# Altium schematic sheet PUTTY.SchDoc
size A4
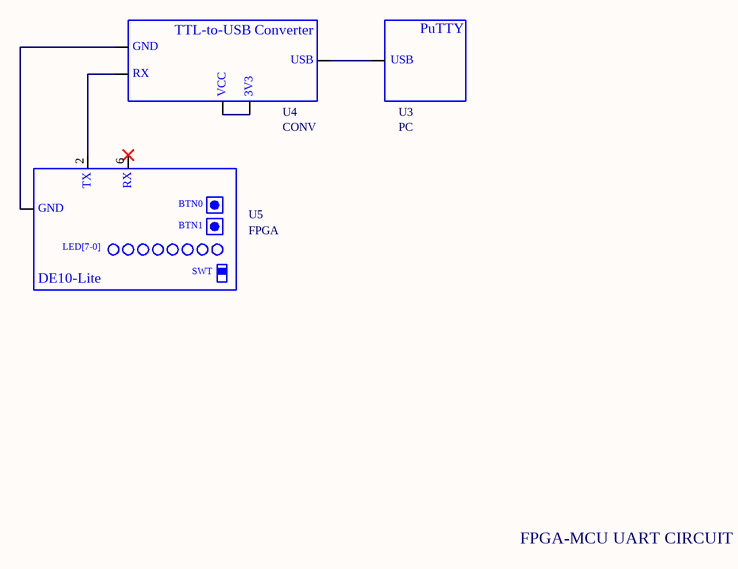
[diagram p0: PUTTY.SchDoc]

## Parts
U3  PC
U4  CONV
U5  FPGA

## Nets
NetU3_0: U3.0 U4.1
NetU4_0: U4.0 U5.3
NetU4_11: U4.11 U4.12
NetU4_16: U4.16 U5.2

Not connected (* = marked no-connect by the designer): U5 6*

## Notes on the sheet
- FPGA-MCU UART CIRCUIT
- (in symbol FPGA) TX; RX; BTN0; GND; BTN1; LED[7-0]; SWT; DE10-Lite
- (in symbol PC) PuTTY; USB
- (in symbol TTL2USB) TTL-to-USB Converter; GND; USB; RX; VCC; 3V3

## Library data of the parts
U4 = TTL2USB